# EAGLE design Navboard2 (EAGLE 7.6.0)
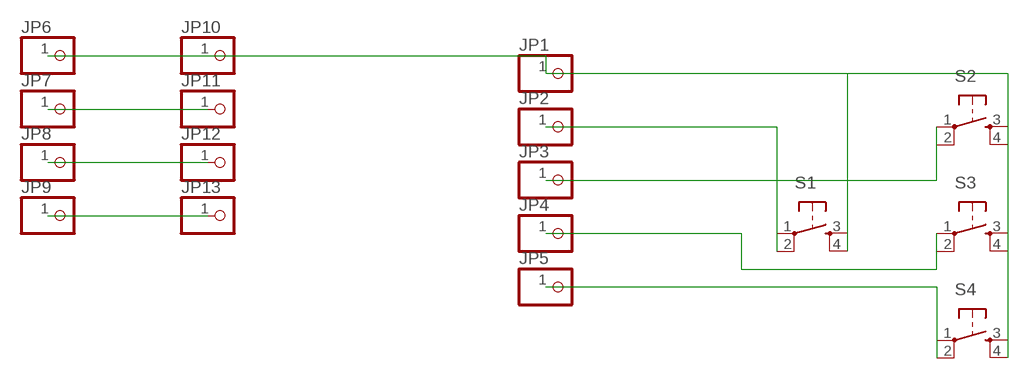
[diagram p0: schematic, sheet 1]

## Parts
JP1  PINHD-1X1  [1X01]
JP2  PINHD-1X1  [1X01]
JP3  PINHD-1X1  [1X01]
JP4  PINHD-1X1  [1X01]
JP5  PINHD-1X1  [1X01]
JP6  PINHD-1X1  [1X01]
JP7  PINHD-1X1  [1X01]
JP8  PINHD-1X1  [1X01]
JP9  PINHD-1X1  [1X01]
JP10  PINHD-1X1  [1X01]
JP11  PINHD-1X1  [1X01]
JP12  PINHD-1X1  [1X01]
JP13  PINHD-1X1  [1X01]
S1  TAC_SWITCHPTH  [TACTILE-PTH]
S2  TAC_SWITCHPTH  [TACTILE-PTH]
S3  TAC_SWITCHPTH  [TACTILE-PTH]
S4  TAC_SWITCHPTH  [TACTILE-PTH]

## Nets
GND: JP1.1 JP6.1 JP10.1 S1.3 S1.4 S2.3 S2.4 S3.3 S3.4 S4.3 S4.4
N$2: JP2.1 S1.1 S1.2
N$3: JP3.1 S2.1 S2.2
N$4: JP4.1 S3.1 S3.2
N$5: JP5.1 S4.1 S4.2
N$6: JP7.1 JP11.1
N$7: JP8.1 JP12.1
N$8: JP9.1 JP13.1

## Library data of the parts
JP1-JP13 = adafruit:PINHD-1X1: Pin header 1x1 for 0.1" spacing With round pins
S1-S4 = SparkFun-Retired:TAC_SWITCH: Momentary Switch Button commonly used for reset or general input. Spark Fun Electronics SKU : COM-00097 SMT- SWCH-08247

## Board
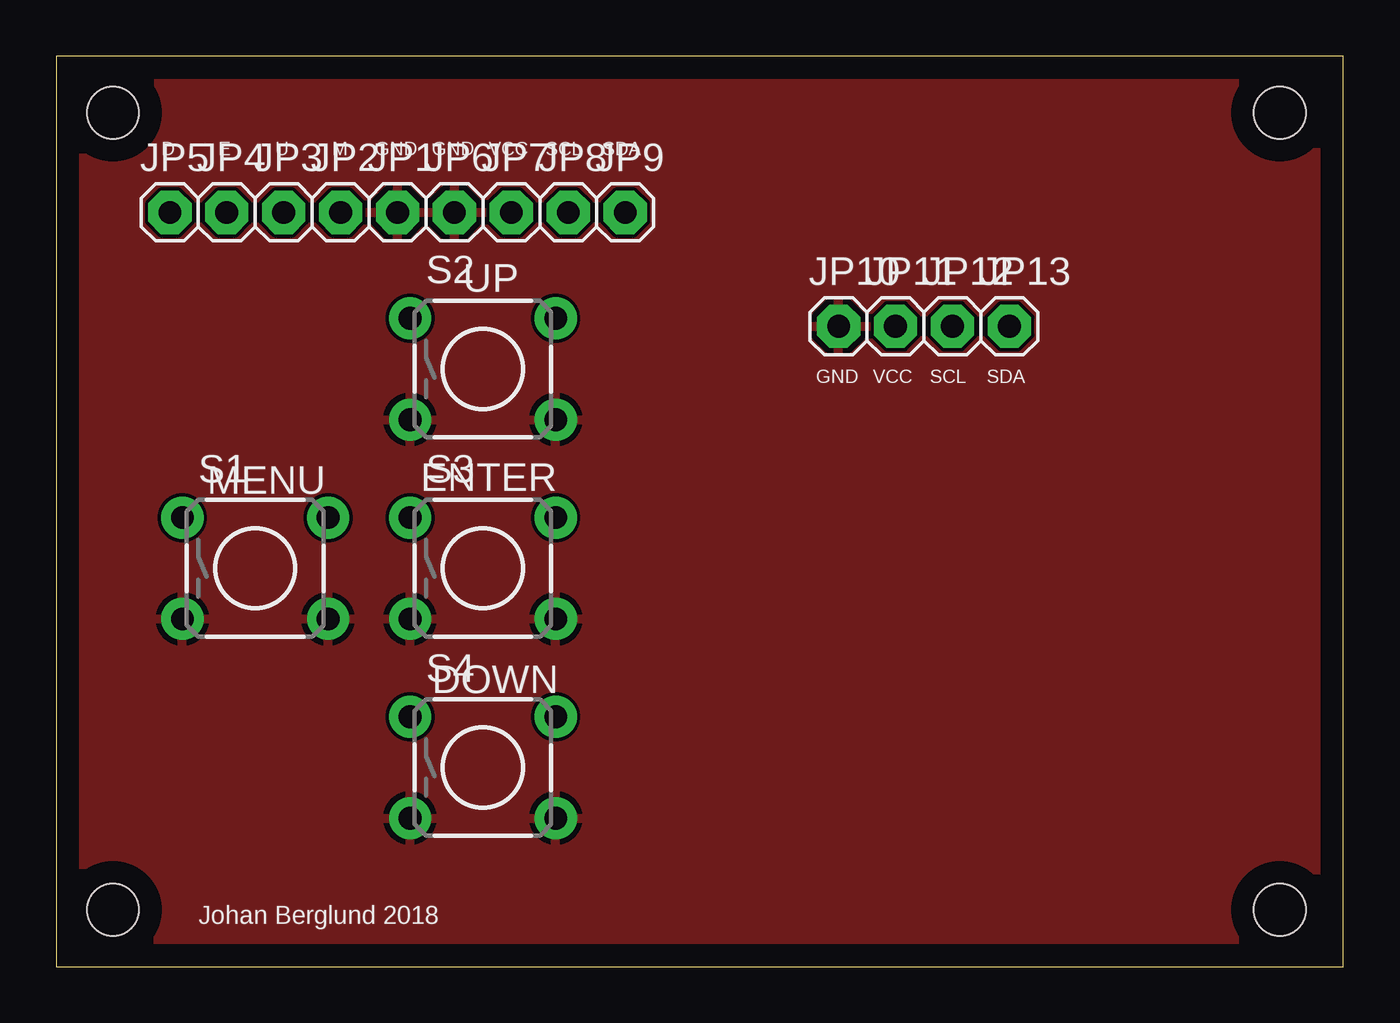
[diagram p1: board, top side]
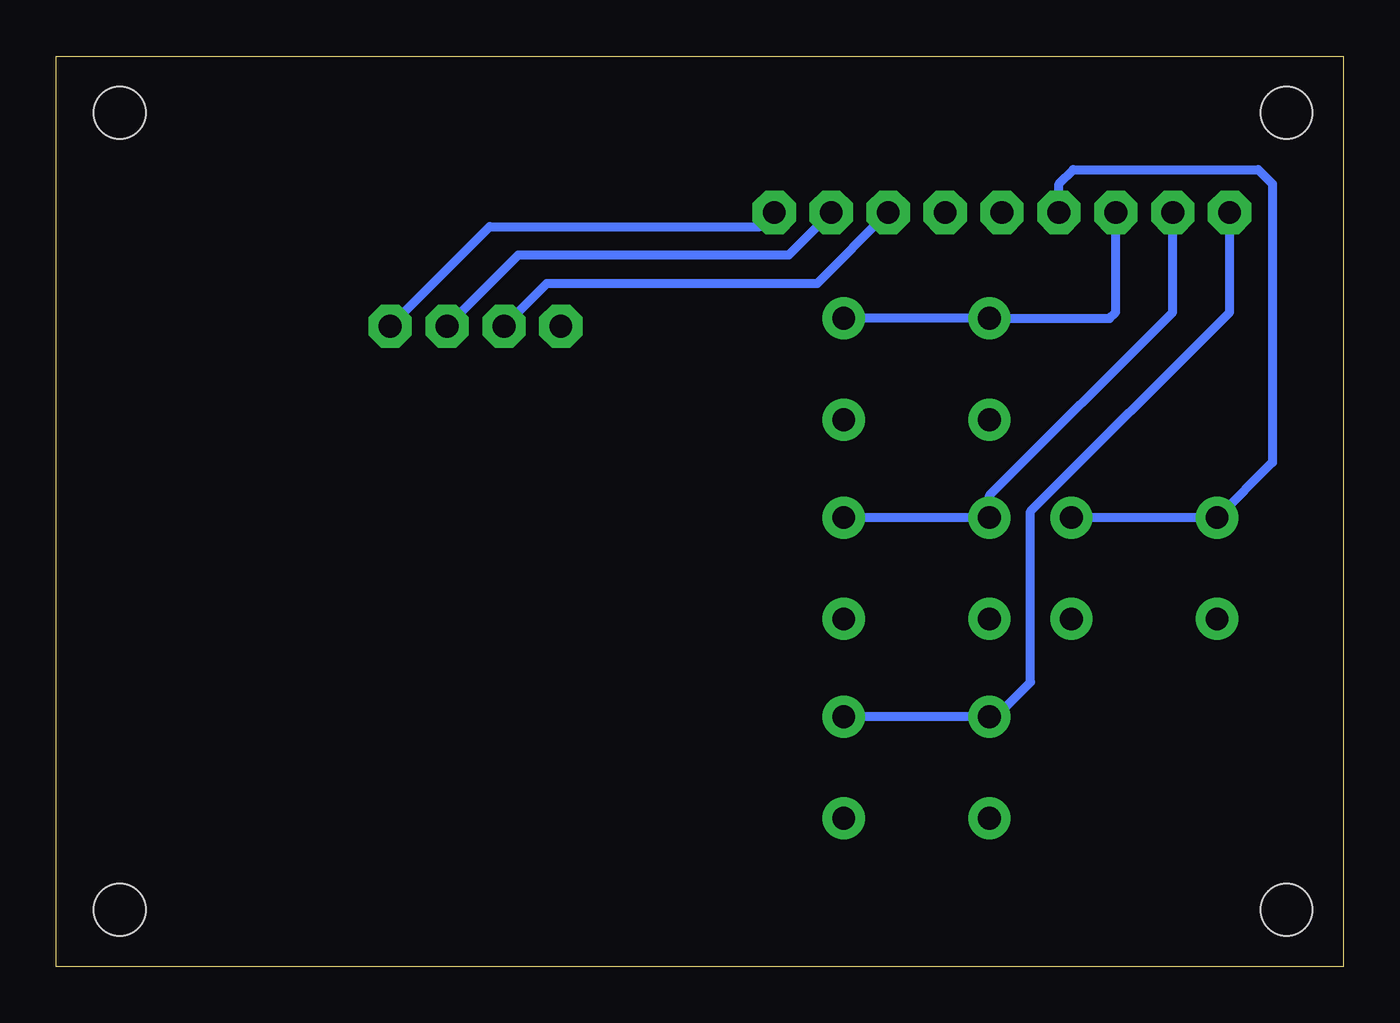
[diagram p2: board, bottom side, seen from below]

Size 57.45 x 40.63 mm. Coordinates in mm from the lower left corner, seen from the top.
Outline: 0,0 57.45,0 57.45,40.63 0,40.63 0,0
Copper layers (1*16): Top 0.035mm / dielectric 1.5mm / Bottom 0.035mm
Design rules "default": minimum track width 6mil, minimum drill 0.35mm, track to track 6mil, track to pad 6mil, pad to pad 6mil, via to via 6mil, smd to smd 6mil, copper to edge 40mil, drill to drill 6mil, minimum pad ring 10mil, minimum via ring 8mil, stop-mask expansion 4mil, vias tented up to drill 0mil, thermal gap 10mil
Holes 2.3 mm at 2.54,38.1 2.54,2.54 54.61,2.54 54.61,38.1

### Footprints (pad centres in the part's own frame; a part is rotated, then mirrored left to right if it is on the bottom)
1X01 = drill 1.016 pad 1.93 octagon: 1 0,0
TACTILE-PTH = drill 1.016 pad 1.88: 1 -3.251,2.261; 2 3.251,2.261; 3 -3.251,-2.261; 4 3.251,-2.261

### Placement (x,y rotation side)
JP1  15.24,33.66 0 top
JP2  12.7,33.66 0 top
JP3  10.16,33.66 0 top
JP4  7.62,33.66 0 top
JP5  5.08,33.66 0 top
JP6  17.78,33.66 0 top
JP7  20.32,33.66 0 top
JP8  22.86,33.66 0 top
JP9  25.4,33.66 0 top
JP10  34.92,28.57 0 top
JP11  37.47,28.57 0 top
JP12  40.01,28.57 0 top
JP13  42.55,28.57 0 top
S1  8.89,17.78 0 top
S2  19.05,26.67 0 top
S3  19.05,17.78 0 top
S4  19.05,8.89 0 top

### Tracks (layer width: path | path; a pad name or v marks a point on that pad's centre or on a via)
GND
  pour Top: 0,40.64 57.78,40.64 57.78,0 0,0
N$2
  Bottom 0.406: S1.2 S1.1 3.17,22.5 3.17,34.92 3.81,35.56 12.06,35.56 12.7,34.92 JP2.1
N$3
  Bottom 0.406: S2.2 S2.1 10.44,28.93 10.16,29.21 JP3.1
N$4
  Bottom 0.406: S3.2 S3.1 15.8,21.03 7.62,29.21 JP4.1
N$5
  Bottom 0.406: S4.2 S4.1 15.52,11.15 13.97,12.7 13.97,20.32 5.08,29.21 JP5.1
N$6
  Bottom 0.406: JP7.1 23.5,30.48 35.56,30.48 JP11.1
N$7
  Bottom 0.406: JP8.1 24.77,31.75 36.83,31.75 JP12.1
N$8
  Bottom 0.406: JP13.1 38.1,33.02 26.04,33.02 JP9.1

### Text on the board
tSilk: Johan Berglund 2018
_tsilk: D | E | U | M | GND | GND | VCC | SCL | SDA | UP | GND | VCC | SCL | SDA | MENU | ENTER | DOWN